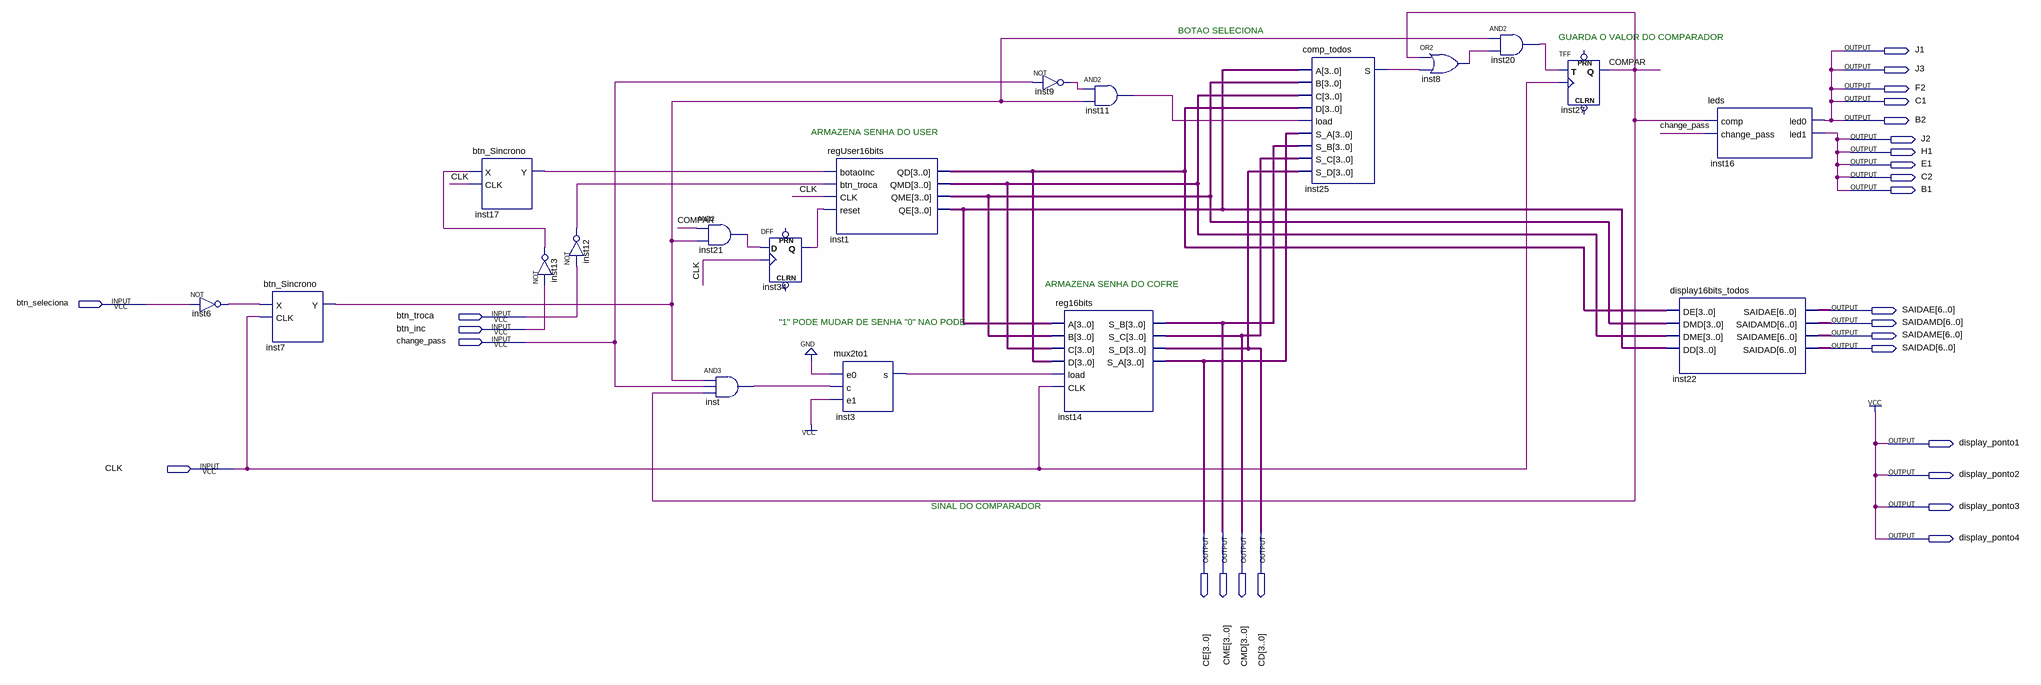
[diagram p0: schematic sheet]
// Quartus schematic proj_final_16bits.bdf as structural Verilog: 19 symbols, 27 pins
module proj_final_16bits (
  input  btn_seleciona,
  input  btn_troca,
  input  btn_inc,
  input  change_pass,
  input  CLK,
  output J1,
  output J3,
  output F2,
  output C1,
  output B2,
  output J2,
  output H1,
  output E1,
  output C2,
  output B1,
  output [6:0] SAIDAE,
  output [6:0] SAIDAMD,
  output [6:0] SAIDAME,
  output [6:0] SAIDAD,
  output display_ponto1,
  output display_ponto2,
  output display_ponto3,
  output [3:0] CE,
  output [3:0] CME,
  output [3:0] CMD,
  output [3:0] CD,
  output display_ponto4
);

  wire COMPAR, inst3_s, inst6_out, inst7_y, inst8_out, inst9_out, inst11_out, inst12_out, inst13_out,
       inst17_y, inst20_out, inst21_out, inst25_s, inst34_q, inst_out;
  wire [3:0] inst1_qd, inst1_qe, inst1_qmd, inst1_qme;

  not inst6 (inst6_out, btn_seleciona);
  btn_Sincrono inst7 (.X(inst6_out), .CLK(CLK), .Y(inst7_y));
  btn_Sincrono inst17 (.X(inst13_out), .CLK(CLK), .Y(inst17_y));
  not inst13 (inst13_out, btn_inc);
  not inst12 (inst12_out, btn_troca);
  and inst21 (inst21_out, COMPAR, inst7_y);
  and inst (inst_out, inst7_y, change_pass, COMPAR);
  DFF inst34 (.CLK(CLK), .D(inst21_out), .Q(inst34_q));  // open: CLRN, PRN
  regUser16bits inst1 (
    .botaoInc(inst17_y), .btn_troca(inst12_out), .CLK(CLK), .reset(inst34_q), .QD(inst1_qd), .QMD(inst1_qmd),
    .QME(inst1_qme), .QE(inst1_qe));
  mux2to1 inst3 (.e0(1'b0), .c(inst_out), .e1(1'b1), .s(inst3_s));
  not inst9 (inst9_out, change_pass);
  and inst11 (inst11_out, inst9_out, inst7_y);
  reg16bits inst14 (
    .A(inst1_qe), .B(inst1_qme), .C(inst1_qmd), .D(inst1_qd), .load(inst3_s), .CLK(CLK), .S_B(CME),
    .S_C(CMD), .S_D(CD), .S_A(CE));
  comp_todos inst25 (
    .A(inst1_qe), .B(inst1_qme), .C(inst1_qmd), .D(inst1_qd), .load(inst11_out), .S_A(CE), .S_B(CME),
    .S_C(CMD), .S_D(CD), .S(inst25_s));
  or inst8 (inst8_out, COMPAR, inst25_s);
  and inst20 (inst20_out, inst7_y, inst8_out);
  TFF inst27 (.T(inst20_out), .CLK(CLK), .Q(COMPAR));  // open: PRN, CLRN
  display16bits_todos inst22 (
    .DE(inst1_qd), .DMD(inst1_qme), .DME(inst1_qmd), .DD(inst1_qe), .SAIDAE(SAIDAE), .SAIDAMD(SAIDAMD),
    .SAIDAME(SAIDAME), .SAIDAD(SAIDAD));
  leds inst16 (.comp(COMPAR), .change_pass(change_pass), .led0(B2), .led1(B1));

  assign C1 = B2;
  assign C2 = B1;
  assign display_ponto1 = 1'b1;
  assign display_ponto2 = 1'b1;
  assign display_ponto3 = 1'b1;
  assign display_ponto4 = 1'b1;
  assign E1 = B1;
  assign F2 = B2;
  assign H1 = B1;
  assign J1 = B2;
  assign J2 = B1;
  assign J3 = B2;

  // Notes on the sheet:
  //   BOTAO SELECIONA
  //   GUARDA O VALOR DO COMPARADOR
  //   ARMAZENA SENHA DO USER
  //   ARMAZENA SENHA DO COFRE
  //   "1" PODE MUDAR DE SENHA "0" NAO PODE
  //   SINAL DO COMPARADOR
endmodule
